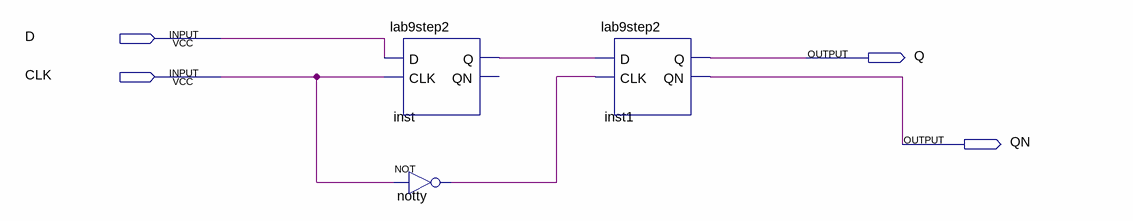
[diagram p0: schematic sheet]
// Quartus schematic lab9step3a.bdf as structural Verilog: 3 symbols, 4 pins
module lab9step3a (
  input  D,
  input  CLK,
  output Q,
  output QN
);

  wire inst_q, notty_out;

  lab9step2 inst (.D(D), .CLK(CLK), .Q(inst_q));  // open: QN
  not notty (notty_out, CLK);
  lab9step2 inst1 (.D(inst_q), .CLK(notty_out), .Q(Q), .QN(QN));
endmodule
